# Altium project Documents.PRJPCB
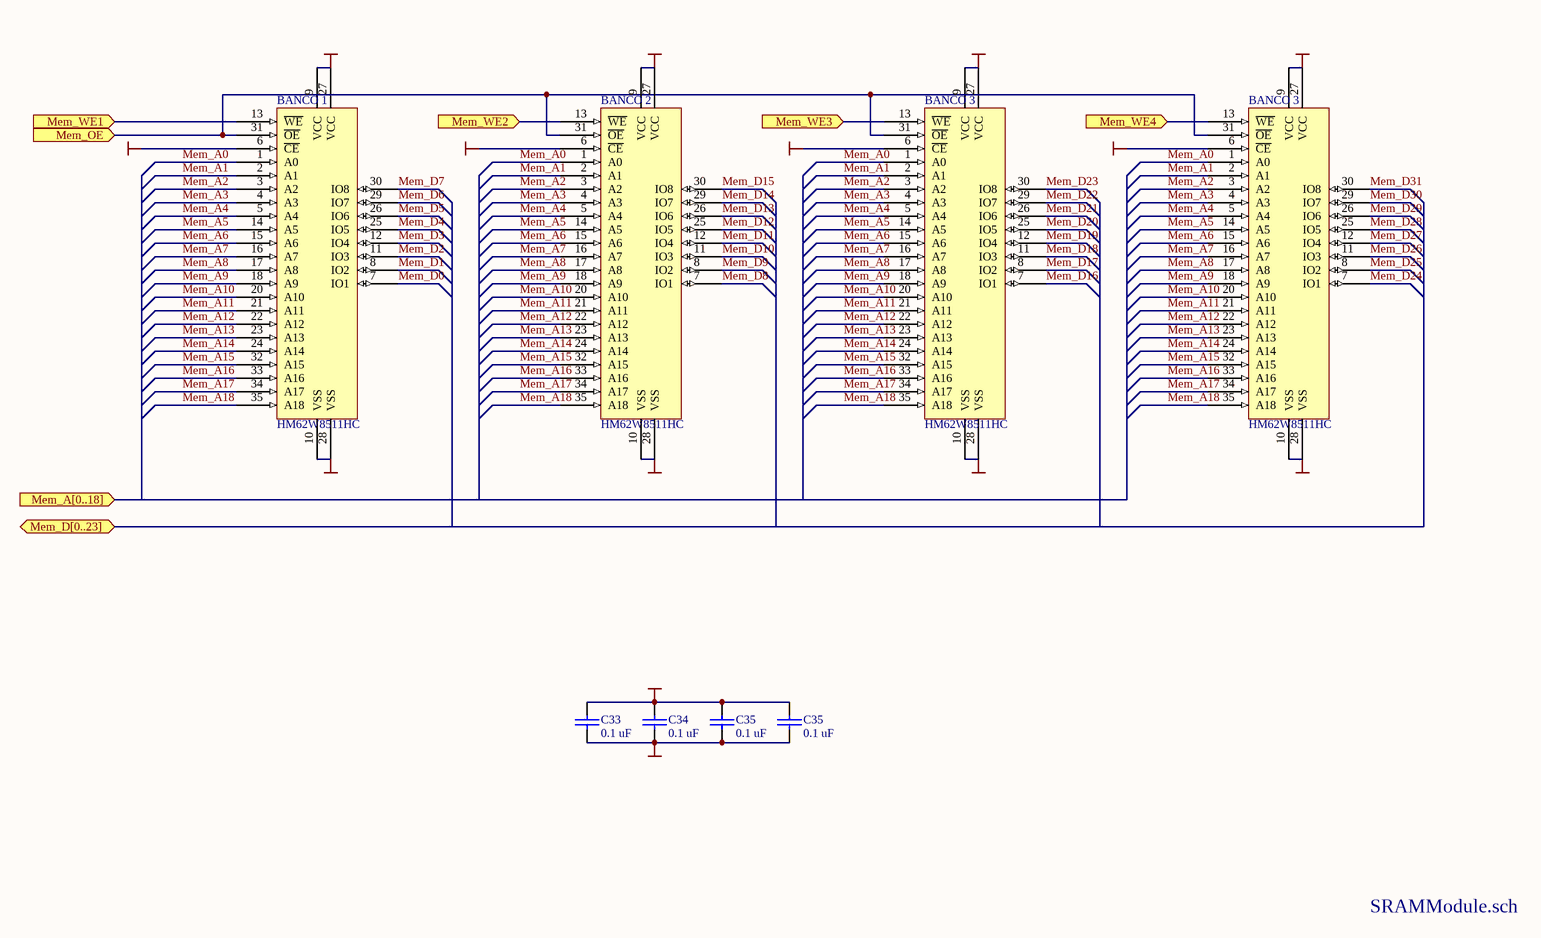
[diagram p0: SRAM_Module.SCHDOC]
2 sheets, 20 parts. Net scope: global (net labels, ports and power ports of the same name join across sheets).
Board file: PCB1.PcbDoc
Sheets:
  SRAM_Module.SCHDOC
  Puerto VGA.SchDoc

## Sheet SRAM_Module.SCHDOC
size B; SheetNumber: 2; SheetTotal: 7

### Parts
(Parts that share a designator on the sheet are numbered #1, #2 ... from top to bottom, then left to right.)
BANCO_1  HM62W8511HC  [SOJ36/400]
BANCO_2  HM62W8511HC  [SOJ36/400]
BANCO_3#1  HM62W8511HC  [SOJ36/400]
BANCO_3#2  HM62W8511HC  [SOJ36/400]
C33  0.1 uF  [CAP 10]
C34  0.1 uF  [CAP 10]
C35#1  0.1 uF  [CAP 10]
C35#2  0.1 uF  [CAP 10]

### Ports
Mem_A[0..18] (in), Mem_D[0..23] (bidir), Mem_OE (in), Mem_WE1 (in), Mem_WE2 (in), Mem_WE3 (in), Mem_WE4 (in)

### Nets
GND: BANCO_1.6(~{CE}) BANCO_1.10(VSS) BANCO_1.28(VSS) BANCO_2.6(~{CE}) BANCO_2.10(VSS) BANCO_2.28(VSS) BANCO_3#1.6(~{CE}) BANCO_3#1.10(VSS) BANCO_3#1.28(VSS) BANCO_3#2.6(~{CE}) BANCO_3#2.10(VSS) BANCO_3#2.28(VSS) C33.2 C34.2 C35#1.2 C35#2.2  [also labelled VSS]
VCC: BANCO_1.9(VCC) BANCO_1.27(VCC) BANCO_2.9(VCC) BANCO_2.27(VCC) BANCO_3#1.9(VCC) BANCO_3#1.27(VCC) BANCO_3#2.9(VCC) BANCO_3#2.27(VCC) C33.1 C34.1 C35#1.1 C35#2.1  [also labelled VCC_3.3V]
Mem_A0: BANCO_1.1(A0) BANCO_2.1(A0) BANCO_3#1.1(A0) BANCO_3#2.1(A0)
Mem_A1: BANCO_1.2(A1) BANCO_2.2(A1) BANCO_3#1.2(A1) BANCO_3#2.2(A1)
Mem_A2: BANCO_1.3(A2) BANCO_2.3(A2) BANCO_3#1.3(A2) BANCO_3#2.3(A2)
Mem_A3: BANCO_1.4(A3) BANCO_2.4(A3) BANCO_3#1.4(A3) BANCO_3#2.4(A3)
Mem_A4: BANCO_1.5(A4) BANCO_2.5(A4) BANCO_3#1.5(A4) BANCO_3#2.5(A4)
Mem_A5: BANCO_1.14(A5) BANCO_2.14(A5) BANCO_3#1.14(A5) BANCO_3#2.14(A5)
Mem_A6: BANCO_1.15(A6) BANCO_2.15(A6) BANCO_3#1.15(A6) BANCO_3#2.15(A6)
Mem_A7: BANCO_1.16(A7) BANCO_2.16(A7) BANCO_3#1.16(A7) BANCO_3#2.16(A7)
Mem_A8: BANCO_1.17(A8) BANCO_2.17(A8) BANCO_3#1.17(A8) BANCO_3#2.17(A8)
Mem_A9: BANCO_1.18(A9) BANCO_2.18(A9) BANCO_3#1.18(A9) BANCO_3#2.18(A9)
Mem_A10: BANCO_1.20(A10) BANCO_2.20(A10) BANCO_3#1.20(A10) BANCO_3#2.20(A10)
Mem_A11: BANCO_1.21(A11) BANCO_2.21(A11) BANCO_3#1.21(A11) BANCO_3#2.21(A11)
Mem_A12: BANCO_1.22(A12) BANCO_2.22(A12) BANCO_3#1.22(A12) BANCO_3#2.22(A12)
Mem_A13: BANCO_1.23(A13) BANCO_2.23(A13) BANCO_3#1.23(A13) BANCO_3#2.23(A13)
Mem_A14: BANCO_1.24(A14) BANCO_2.24(A14) BANCO_3#1.24(A14) BANCO_3#2.24(A14)
Mem_A15: BANCO_1.32(A15) BANCO_2.32(A15) BANCO_3#1.32(A15) BANCO_3#2.32(A15)
Mem_A16: BANCO_1.33(A16) BANCO_2.33(A16) BANCO_3#1.33(A16) BANCO_3#2.33(A16)
Mem_A17: BANCO_1.34(A17) BANCO_2.34(A17) BANCO_3#1.34(A17) BANCO_3#2.34(A17)
Mem_A18: BANCO_1.35(A18) BANCO_2.35(A18) BANCO_3#1.35(A18) BANCO_3#2.35(A18)
Mem_D0: BANCO_1.7(IO1)
Mem_D1: BANCO_1.8(IO2)
Mem_D2: BANCO_1.11(IO3)
Mem_D3: BANCO_1.12(IO4)
Mem_D4: BANCO_1.25(IO5)
Mem_D5: BANCO_1.26(IO6)
Mem_D6: BANCO_1.29(IO7)
Mem_D7: BANCO_1.30(IO8)
Mem_D8: BANCO_2.7(IO1)
Mem_D9: BANCO_2.8(IO2)
Mem_D10: BANCO_2.11(IO3)
Mem_D11: BANCO_2.12(IO4)
Mem_D12: BANCO_2.25(IO5)
Mem_D13: BANCO_2.26(IO6)
Mem_D14: BANCO_2.29(IO7)
Mem_D15: BANCO_2.30(IO8)
Mem_D16: BANCO_3#1.7(IO1)
Mem_D17: BANCO_3#1.8(IO2)
Mem_D18: BANCO_3#1.11(IO3)
Mem_D19: BANCO_3#1.12(IO4)
Mem_D20: BANCO_3#1.25(IO5)
Mem_D21: BANCO_3#1.26(IO6)
Mem_D22: BANCO_3#1.29(IO7)
Mem_D23: BANCO_3#1.30(IO8)
Mem_D24: BANCO_3#2.7(IO1)
Mem_D25: BANCO_3#2.8(IO2)
Mem_D26: BANCO_3#2.11(IO3)
Mem_D27: BANCO_3#2.12(IO4)
Mem_D28: BANCO_3#2.25(IO5)
Mem_D29: BANCO_3#2.26(IO6)
Mem_D30: BANCO_3#2.29(IO7)
Mem_D31: BANCO_3#2.30(IO8)
NetBANCO_1_13: BANCO_1.13(~{WE}) ; port Mem_WE1
NetBANCO_1_31: BANCO_1.31(~{OE}) BANCO_2.31(~{OE}) BANCO_3#1.31(~{OE}) BANCO_3#2.31(~{OE}) ; port Mem_OE
NetBANCO_2_13: BANCO_2.13(~{WE}) ; port Mem_WE2
NetBANCO_3#1_13: BANCO_3#1.13(~{WE}) ; port Mem_WE3
NetBANCO_3#2_13: BANCO_3#2.13(~{WE}) ; port Mem_WE4

### Notes on the sheet
- SRAMModule.sch

### Library data of the parts
C33 C34 C35#1 C35#2 = CAP: Capacitor

## Sheet Puerto VGA.SchDoc
size B
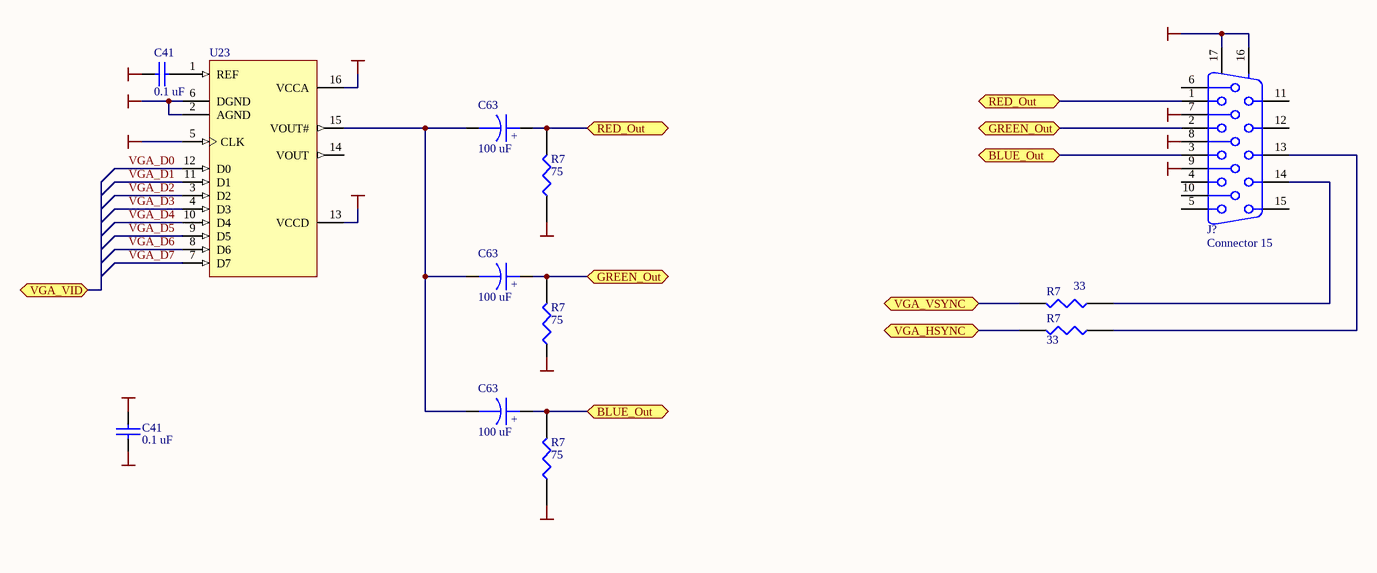
[diagram p1: Puerto VGA.SchDoc]

### Parts
(Parts that share a designator on the sheet are numbered #1, #2 ... from top to bottom, then left to right.)
C41#1  0.1 uF  [CAP 10]
C41#2  0.1 uF  [CAP 10]
C63#1  100 uF  [CAPACITOR GRANDE 2]
C63#2  100 uF  [CAPACITOR GRANDE 2]
C63#3  100 uF  [CAPACITOR GRANDE 2]
J?  Connector 15  [050DSUB0.762-4H15]
R7#1  75  [AXIAL-0.4]
R7#2  33  [AXIAL-0.4]
R7#3  75  [AXIAL-0.4]
R7#4  33  [AXIAL-0.4]
R7#5  75  [AXIAL-0.4]
U23  (no value)

### Ports
BLUE_Out, GREEN_Out, RED_Out, VGA_HSYNC, VGA_VID, VGA_VSYNC

### Nets
GND: C41#1.1 C41#2.1 J?.7 J?.8 J?.9 J?.16(MH1) J?.17(MH2) R7#1.1 R7#5.1 U23.2(AGND) U23.5(CLK) U23.6(DGND)
VCC_5V: C41#2.2 U23.13(VCCD) U23.16(VCCA)
VGA_D0: U23.12(D0)
VGA_D1: U23.11(D1)
VGA_D2: U23.3(D2)
VGA_D3: U23.4(D3)
VGA_D4: U23.10(D4)
VGA_D5: U23.9(D5)
VGA_D6: U23.8(D6)
VGA_D7: U23.7(D7)
NetC41#1_2: C41#1.2 U23.1(REF)
NetC63#1_1: C63#1.1 J?.1 R7#1.2 ; port RED_Out
NetC63#1_2: C63#1.2 C63#2.2 C63#3.2 U23.15(VOUT#)
NetC63#2_1: C63#2.1 J?.2 R7#3.2 ; port GREEN_Out
NetC63#3_1: C63#3.1 J?.3 R7#5.2 ; port BLUE_Out
NetJ?_13: J?.13 R7#4.1
NetJ?_14: J?.14 R7#2.1
NetR7#2_2: R7#2.2 ; port VGA_VSYNC
NetR7#4_2: R7#4.2 ; port VGA_HSYNC

Not connected (* = marked no-connect by the designer): J? 4 5 6 10 11 12 15; R7#3 1; U23 14(VOUT)

### Notes on the sheet
- Labels drawn without touching a wire or pin: GND
- (in symbol CAPACITOR POL) +

### Library data of the parts
C41#1 C41#2 = CAP: Capacitor
C63#1-C63#3 = CAPACITOR POL: Capacitor
J? = Connector 15: Receptacle Assembly, 15-Pin Connector; Manufacturer: Generic Components; Positions: 15; Gender: Receptacle Header; Published: 15/06/2001; Publisher: Altium Hobart Technology Centre; Class: Connector; Orientation: Right Angle
R7#1-R7#5 = RES1
U23 = TDA8702

## Nets that join several sheets
GND: SRAM_Module (16 pins), Puerto VGA (12 pins)